# Altium schematic sheet msxbreakout_slim.SchDoc
size B; PageSetup: Record=PageOptions|CenterHorizontal=True|CenterVertical=True|PrintScale=0.75|XCorrection=1.00|YCorrection=1.00|PrintKind=0|BorderSize=5000000|LeftOffset=0|BottomOffset=0|Orientation=2|PaperLength=1000|PaperWidth=1000|Scale=100|PaperSource=7|PrintQuality=-4|MediaType=1|DitherType=10|PaperKind=A4 210 x 297 mm|PrintScaleMode=1
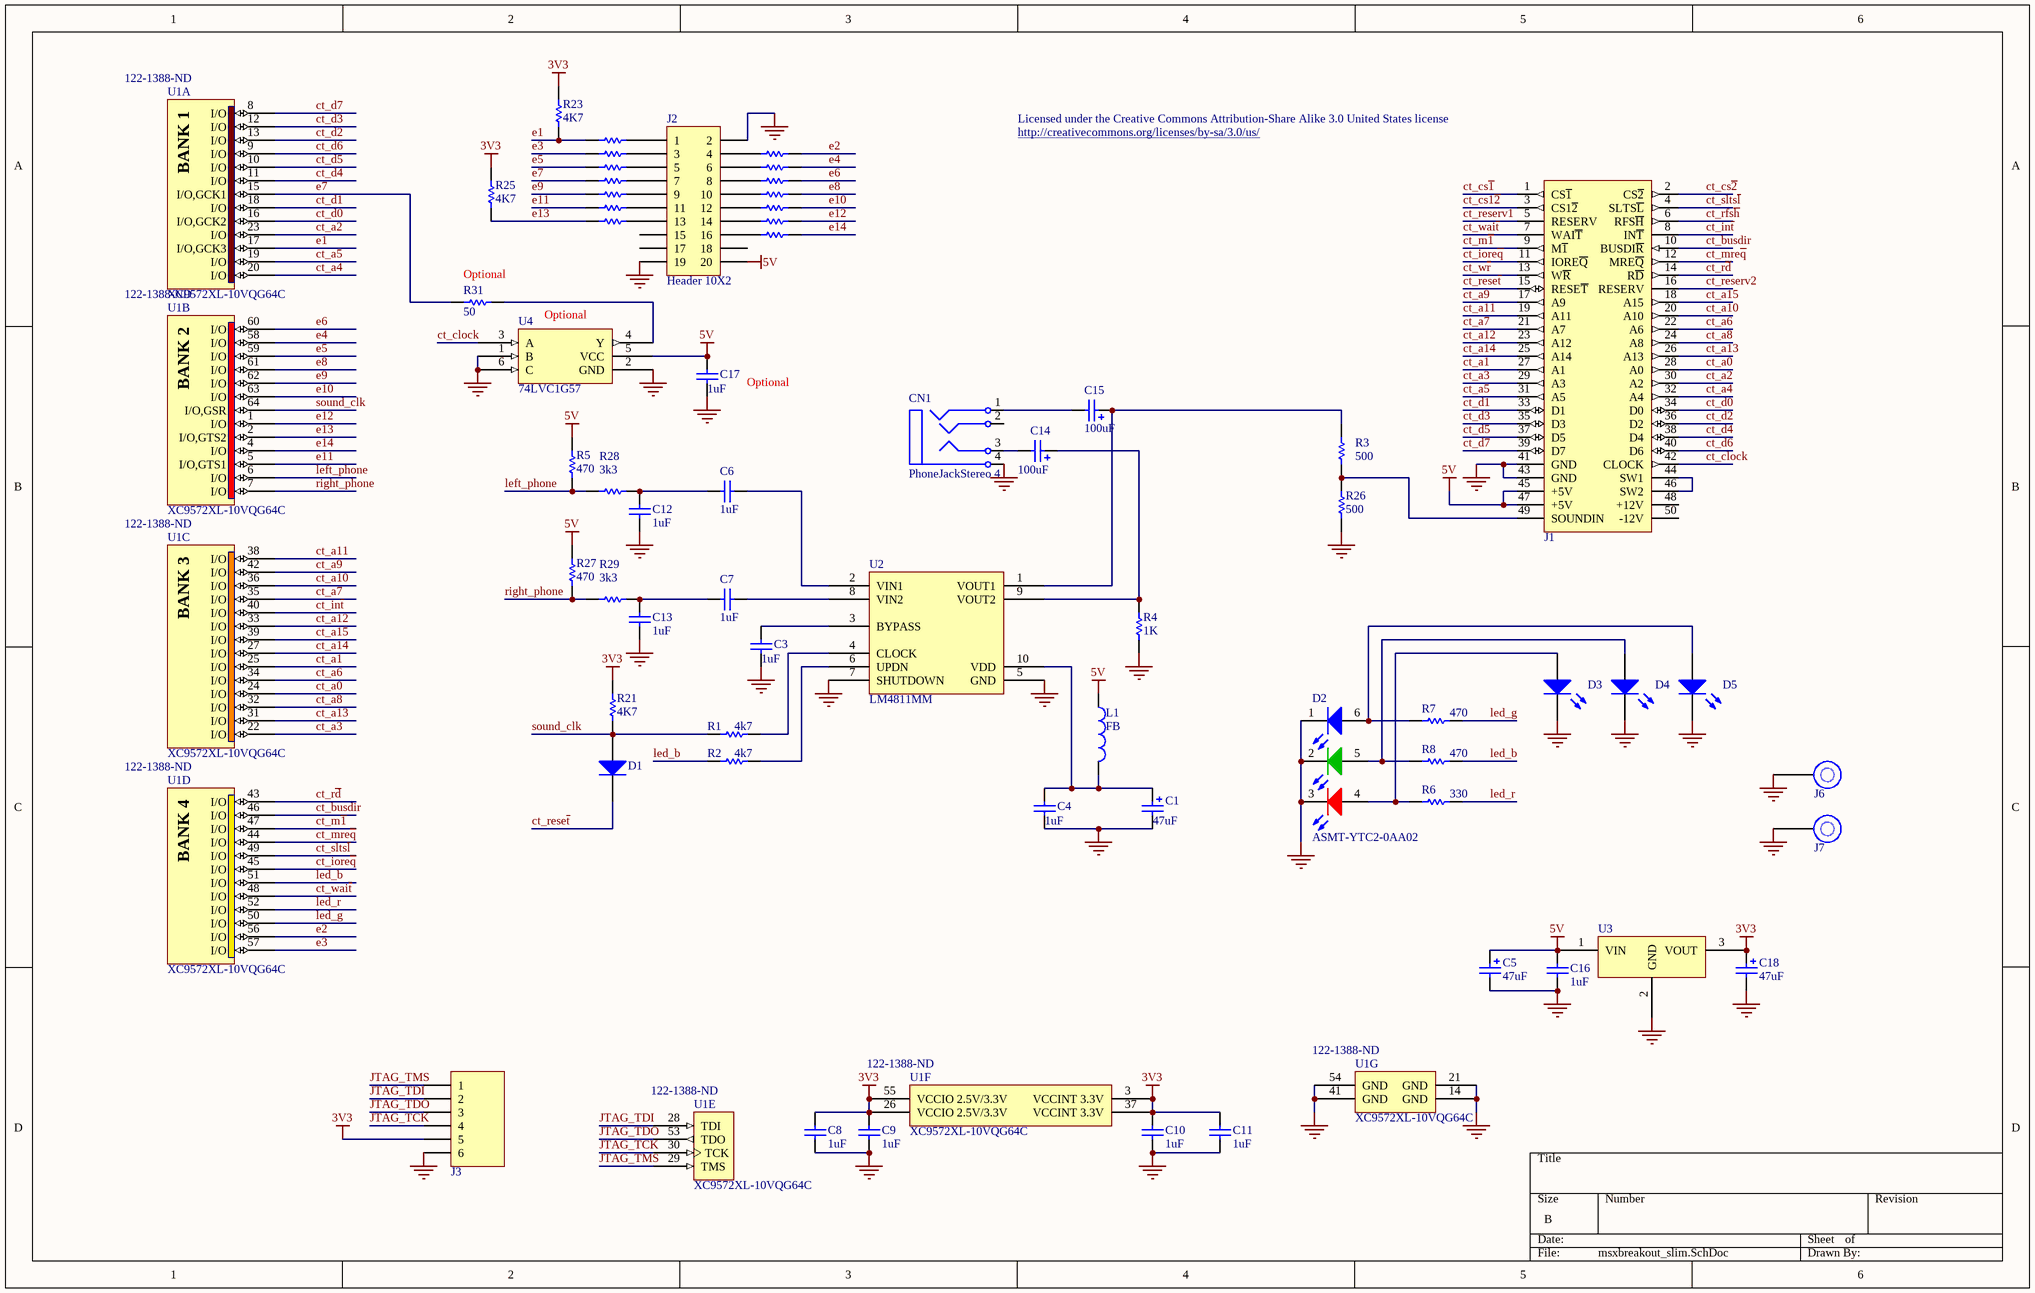
[diagram p0: msxbreakout_slim.SchDoc]

## Parts
C1  value 47uF  [cap1210POL]  (hidden comment: Cap Pol1)
C3  value 1uF  [cap0603]  (hidden comment: Cap)
C4  value 1uF  [cap0603]  (hidden comment: Cap)
C5  value 47uF  [cap1210POL]  (hidden comment: Cap Pol1)
C6  value 1uF  [cap0603]  (hidden comment: Cap)
C7  value 1uF  [cap0603]  (hidden comment: Cap)
C8  value 1uF  [cap0603]  (hidden comment: Cap)
C9  value 1uF  [cap0603]  (hidden comment: Cap)
C10  value 1uF  [cap0603]  (hidden comment: Cap)
C11  value 1uF  [cap0603]  (hidden comment: Cap)
C12  value 1uF  [cap0603]  (hidden comment: Cap)
C13  value 1uF  [cap0603]  (hidden comment: Cap)
C14  value 100uF  [cap1210POL]  (hidden comment: Cap Pol1)
C15  value 100uF  [cap1210POL]  (hidden comment: Cap Pol1)
C16  value 1uF  [cap0603]  (hidden comment: Cap)
C17  value 1uF  [cap0603]  (hidden comment: Cap)
C18  value 47uF  [cap1210POL]  (hidden comment: Cap Pol1)
CN1  PhoneJackStereo 4  [SJ1-2503A]
D1  Diode  [SOD323F]  (value not drawn)
D2  ASMT-YTC2-0AA02  [ASMT-YTC2-0AA02]
D3  APA1606SURCK  [LED-0603_LAMP_RED]  (value not drawn)
D4  APA1606SURCK  [LED-0603_LAMP_GREEN]  (value not drawn)
D5  APA1606SURCK  [LED-0603_LAMP_BLUE]  (value not drawn)
J1  msxcart  [msxcart]  (value not drawn)
J2  Header 10X2  [HDR2X10_90]
J3  Header 1X6  [HDR1X6_90]  (value not drawn)
J6  MountHole  [MOUNTHOLE]  (value not drawn)
J7  MountHole  [MOUNTHOLE]  (value not drawn)
L1  value FB  [ind1206]  (hidden comment: Inductor)
R1  value 4k7  [res0603]  (hidden comment: Res1)
R2  value 4k7  [res0603]  (hidden comment: Res1)
R3  value 500  [res0603]  (hidden comment: Res1)
R4  value 1K  [res0603]  (hidden comment: Res1)
R5  value 470  [res0603]  (hidden comment: Res1)
R6  value 330  [res0603]  (hidden comment: Res1)
R7  value 470  [res0603]  (hidden comment: Res1)
R8  value 470  [res0603]  (hidden comment: Res1)
R9  Res1  [res0603]  (value not drawn)
R10  Res1  [res0603]  (value not drawn)
R11  Res1  [res0603]  (value not drawn)
R12  Res1  [res0603]  (value not drawn)
R13  Res1  [res0603]  (value not drawn)
R14  Res1  [res0603]  (value not drawn)
R15  Res1  [res0603]  (value not drawn)
R16  Res1  [res0603]  (value not drawn)
R17  Res1  [res0603]  (value not drawn)
R18  Res1  [res0603]  (value not drawn)
R19  Res1  [res0603]  (value not drawn)
R20  Res1  [res0603]  (value not drawn)
R21  value 4K7  [res0603]  (hidden comment: Res1)
R22  Res1  [res0603]  (value not drawn)
R23  value 4K7  [res0603]  (hidden comment: Res1)
R24  Res1  [res0603]  (value not drawn)
R25  value 4K7  [res0603]  (hidden comment: Res1)
R26  value 500  [res0603]  (hidden comment: Res1)
R27  value 470  [res0603]  (hidden comment: Res1)
R28  value 3k3  [res0603]  (hidden comment: Res1)
R29  value 3k3  [res0603]  (hidden comment: Res1)
R31  value 50  [res0603]  (hidden comment: Res1)
U1  XC9572XL-10VQG64C  Supplier Part Number 1: 122-1388-ND  [VQG64_N]  (parts A,B,C,D,E,F,G of 7)
U2  LM4811MM  [LM4811MM]
U3  Regulator 3V3  [sot223_4]  (value not drawn)
U4  74LVC1G57  [SOT-363 PKG]

## Nets
3V3: C8.2 C9.2 C10.2 C11.2 C18.1 J3.5 R21.2 R23.2 R25.2 U1.3(VCCINT_3.3V) U1.26(VCCIO_2.5V/3.3V) U1.37(VCCINT_3.3V) U1.55(VCCIO_2.5V/3.3V) U3.3(VOUT)
5V: C5.1 C16.2 C17.2 J1.45(+5V) J1.47(+5V) J2.20 L1.1 R5.2 R27.2 U3.1(VIN) U4.5(VCC)
GND: C1.2 C3.1 C4.1 C5.2 C8.1 C9.1 C10.1 C11.1 C12.2 C13.2 C16.1 C17.1 C18.2 CN1.4 D2.1 D2.2 D2.3 D3.2(K) D4.2(K) D5.2(K) J1.41(GND) J1.43(GND) J2.2 J2.19 J3.6 J6.1 J7.1 R4.1 R26.1 U1.14(GND) U1.21(GND) U1.41(GND) U1.54(GND) U2.5(GND) U2.7(SHUTDOWN) U3.2(GND) U4.1(B) U4.2(GND) U4.6(C)
ct_a0: J1.28(A0) U1.24(I/O)
ct_a1: J1.27(A1) U1.25(I/O)
ct_a2: J1.30(A2) U1.23(I/O)
ct_a3: J1.29(A3) U1.22(I/O)
ct_a4: J1.32(A4) U1.20(I/O)
ct_a5: J1.31(A5) U1.19(I/O)
ct_a6: J1.22(A6) U1.34(I/O)
ct_a7: J1.21(A7) U1.35(I/O)
ct_a8: J1.24(A8) U1.32(I/O)
ct_a9: J1.17(A9) U1.42(I/O)
ct_a10: J1.20(A10) U1.36(I/O)
ct_a11: J1.19(A11) U1.38(I/O)
ct_a12: J1.23(A12) U1.33(I/O)
ct_a13: J1.26(A13) U1.31(I/O)
ct_a14: J1.25(A14) U1.27(I/O)
ct_a15: J1.18(A15) U1.39(I/O)
ct_busdir: J1.10(BUSDI~{R}) U1.46(I/O)
ct_clock: J1.42(CLOCK) U4.3(A)
ct_cs~{1}: J1.1(CS~{1})
ct_cs~{2}: J1.2(CS~{2})
ct_cs1~{2}: J1.3(CS1~{2})
ct_d0: J1.34(D0) U1.16(I/O,GCK2)
ct_d1: J1.33(D1) U1.18(I/O)
ct_d2: J1.36(D2) U1.13(I/O)
ct_d3: J1.35(D3) U1.12(I/O)
ct_d4: J1.38(D4) U1.11(I/O)
ct_d5: J1.37(D5) U1.10(I/O)
ct_d6: J1.40(D6) U1.9(I/O)
ct_d7: J1.39(D7) U1.8(I/O)
ct_in~{t}: J1.8(IN~{T}) U1.40(I/O)
ct_iore~{q}: J1.11(IORE~{Q}) U1.45(I/O)
ct_m~{1}: J1.9(M~{1}) U1.47(I/O)
ct_mre~{q}: J1.12(MRE~{Q}) U1.44(I/O)
ct_r~{d}: J1.14(R~{D}) U1.43(I/O)
ct_reserv1: J1.5(RESERV)
ct_reserv2: J1.16(RESERV)
ct_rese~{t}: D1.K J1.15(RESE~{T})
ct_rfs~{h}: J1.6(RFS~{H})
ct_slts~{l}: J1.4(SLTS~{L}) U1.49(I/O)
ct_wai~{t}: J1.7(WAI~{T}) U1.48(I/O)
ct_w~{r}: J1.13(W~{R})
e1: R9.1 R23.1 U1.17(I/O,GCK3)
e2: R11.2 U1.56(I/O)
e3: R10.1 U1.57(I/O)
e4: R13.2 U1.58(I/O)
e5: R12.1 U1.59(I/O)
e6: R15.2 U1.60(I/O)
e7: R14.1 R31.1 U1.15(I/O,GCK1)
e8: R18.2 U1.61(I/O)
e9: R16.1 U1.62(I/O)
e10: R20.2 U1.63(I/O)
e11: R17.1 U1.5(I/O,GTS1)
e12: R22.2 U1.1(I/O)
e13: R19.1 R25.1 U1.2(I/O,GTS2)
e14: R24.2 U1.4(I/O)
JTAG_TCK: J3.4 U1.30(TCK)
JTAG_TDI: J3.2 U1.28(TDI)
JTAG_TDO: J3.3 U1.53(TDO)
JTAG_TMS: J3.1 U1.29(TMS)
led_b: R2.1 R8.2 U1.51(I/O)
led_g: R7.2 U1.50(I/O)
led_r: R6.2 U1.52(I/O)
left_phone: R5.1 R28.1 U1.6(I/O)
right_phone: R27.1 R29.1 U1.7(I/O)
sound_clk: D1.A R1.1 R21.1 U1.64(I/O,GSR)
NetC1_1: C1.1 C4.2 L1.2 U2.10(VDD)
NetC3_2: C3.2 U2.3(BYPASS)
NetC6_1: C6.1 U2.2(VIN1)
NetC6_2: C6.2 C12.1 R28.2
NetC7_1: C7.1 U2.8(VIN2)
NetC7_2: C7.2 C13.1 R29.2
NetC14_1: C14.1 R4.2 U2.9(VOUT2)
NetC14_2: C14.2 CN1.3
NetC15_1: C15.1 R3.2 U2.1(VOUT1)
NetC15_2: C15.2 CN1.1
NetD2_4: D2.4 D3.1(A) R6.1
NetD2_5: D2.5 D4.1(A) R8.1
NetD2_6: D2.6 D5.1(A) R7.1
NetJ1_44: J1.44(SW1) J1.46(SW2)
NetJ1_49: J1.49(SOUNDIN) R3.1 R26.2
NetJ2_1: J2.1 R9.2
NetJ2_3: J2.3 R10.2
NetJ2_4: J2.4 R11.1
NetJ2_5: J2.5 R12.2
NetJ2_6: J2.6 R13.1
NetJ2_7: J2.7 R14.2
NetJ2_8: J2.8 R15.1
NetJ2_9: J2.9 R16.2
NetJ2_10: J2.10 R18.1
NetJ2_11: J2.11 R17.2
NetJ2_12: J2.12 R20.1
NetJ2_13: J2.13 R19.2
NetJ2_14: J2.14 R22.1
NetJ2_16: J2.16 R24.1
NetR1_2: R1.2 U2.4(CLOCK)
NetR2_2: R2.2 U2.6(UPDN)
NetR31_2: R31.2 U4.4(Y)

Not connected (* = marked no-connect by the designer): CN1 2; J1 48(+12V) 50(-12V); J2 15 17 18

## Notes on the sheet
- Licensed under the Creative Commons Attribution-Share Alike 3.0 United States license
- http://creativecommons.org/licenses/by-sa/3.0/us/
- (near R31) Optional
- (near U4) Optional
- (near C17) Optional
- (in symbol XC9572XL-10VQG64C, part A) BANK 1
- (in symbol XC9572XL-10VQG64C, part B) BANK 2
- (in symbol XC9572XL-10VQG64C, part C) BANK 3
- (in symbol XC9572XL-10VQG64C, part D) BANK 4

## Library data of the parts
C1 C5 C14 C15 C18 = Cap Pol1: Polarized Capacitor; Published: 8-Jun-2000; LatestRevisionDate: 17-Jul-2002; LatestRevisionNote: Re-released for DXP Platform.; PackageReference: RB7.6-15; Publisher: Altium Limited
C3 C4 C6-C13 C16 C17 = Cap: Capacitor; Published: 8-Jun-2000; LatestRevisionDate: 17-Jul-2002; LatestRevisionNote: Re-released for DXP Platform.; PackageReference: RAD-0.3; Publisher: Altium Limited
CN1 = PhoneJackStereo4
D1 = Diode: Default Diode; Published: 8-Jun-2000; LatestRevisionDate: 17-Jul-2002; LatestRevisionNote: Re-released for DXP Platform.; PackageDocument: Sep-1996; PackageReference: SMC; Publisher: Altium Limited; Code_JEDEC: DO-214-AB
D2 = ASMT-YTC2-0AA02: Typical RED, GREEN, YELLOW, AMBER GaAs LED; Published: 8-Jun-2000; LatestRevisionDate: 17-Jul-2002; LatestRevisionNote: Re-released for DXP Platform.; PackageDocument: Feb-2002; PackageReference: 3.2X1.6X1.1; Publisher: Altium Limited
D3-D5 = APA1606SURCK: 1.6x0.6mm RIGHT ANGLE SMD CHIP LED LAMP, Hyper Red; #Parts: APA1606SURCK; Supplier 1: Digi-Key; Supplier Part Number 1: 754-1054-1-ND
J2 = Header 10X2: Header, 10-Pin, Dual row
J3 = Header 1X6: Header, 6-Pin, Single row
J6 J7 = MountHole: Mounting hole
L1 = Inductor: Code_IEC: 1005; Published: 8-Jun-2000; LatestRevisionDate: 17-Jul-2002; LatestRevisionNote: Re-released for DXP Platform.; PackageReference: 0402-A; Publisher: Altium Limited; Code_JEITA: 0402
R1-R8 R21 R23 R25-R29 R31 = Res1: Resistor; Published: 8-Jun-2000; LatestRevisionDate: 17-Jul-2002; LatestRevisionNote: Re-released for DXP Platform.; PackageReference: AXIAL-0.3; Publisher: Altium Limited
R9-R20 R22 R24 = Res1: Resistor; Value: 50; Published: 8-Jun-2000; LatestRevisionDate: 17-Jul-2002; LatestRevisionNote: Re-released for DXP Platform.; PackageReference: AXIAL-0.3; Publisher: Altium Limited
U1 = XC9572XL-10VQG64C: FastFLASH XC900XL, 3.3V High-Performance 72 Macrocell CPLD, 52 User I/Os, 64-Pin VQFP, Speed Grade 10, Commercial Grade, Pb-Free; DatasheetVersion: ver2.0 Apr-2007; PackageVersion: ver1.2, Jun-2004; PackageReference: VQG64; PackageDescription: 64-Pin Very Thin Quad Flat Pack (VQG64) - Pb-Free; Code_JEDEC: MS-026-ACD; ComponentLink1Description: Manufacturer URL; ComponentLink1URL: http://www.xilinx.com/; ComponentLink2Description: XC9572XL Datasheet; ComponentLink2URL: http://www.xilinx.com/support/documentation/data_sheets/ds057.pdf; ComponentLink3Description: VQG64 Package Drawing; ComponentLink3URL: http://www.xilinx.com/support/documentation/package_specs/vq64.pdf; ComponentLink4Description: XC9500XL Documents; ComponentLink4URL: http://www.xilinx.com/support/documentation/xc9500xl.htm; Supplier 1: Digi-Key